# EAGLE schematic esp32_cam_rev_B (EAGLE 9.6.2)
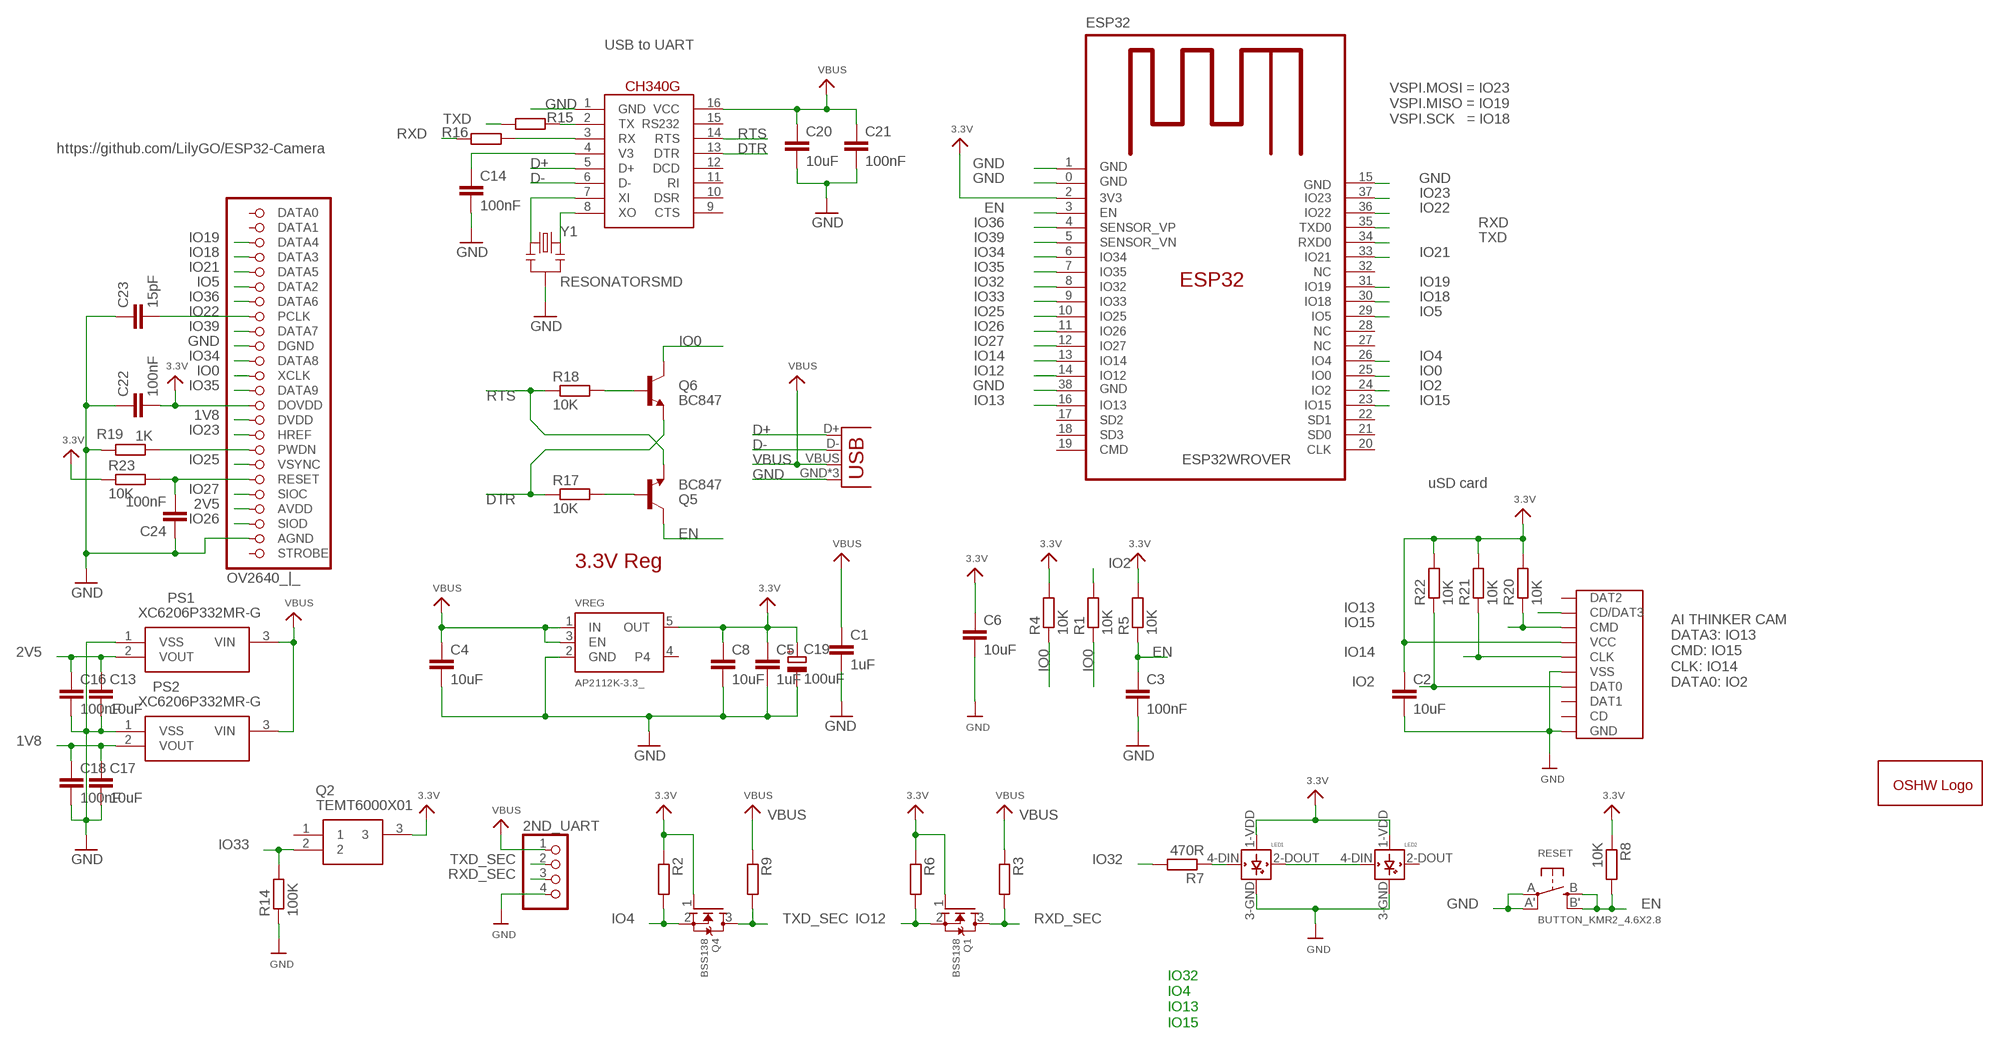
[diagram p0: schematic, sheet 1]

## Parts
2ND_UART  JST_PH4  [JSTPH4]
C1  1uF  C-EUC0805K  [C0805K]
C2  10uF  C-EUC0805  [C0805]
C3  100nF  C-EUC0805K  [C0805K]
C4  10uF  C-EUC0805  [C0805]
C5  1uF  C-EUC0805  [C0805]
C6  10uF  C-EUC0805K  [C0805K]
C8  10uF  C-EUC0805  [C0805]
C13  10uF  C-EUC0805  [C0805]
C14  100nF  C-EUC0805K  [C0805K]
C16  100nF  C-EUC0805  [C0805]
C17  10uF  C-EUC0805  [C0805]
C18  100nF  C-EUC0805  [C0805]
C19  100uF  CPOL-EUCT6032  [CT6032]
C20  10uF  C-EUC0805  [C0805]
C21  100nF  C-EUC0805  [C0805]
C22  100nF  C-EUC0805  [C0805]
C23  15pF  C-EUC0805  [C0805]
C24  100nF  C-EUC0805  [C0805]
CH340G  CH340G  [SO16]
ESP32  ESP32WROVER  [ESP32WROVER]
FPC_CONNECTOR  OV2640_|_  [5051102491]
GOLD_ORB_SM1  OSHWLOGO_  [OSHW_5MM_LOGO]
LED1  WS2812B  [WS2812B_5050]
LED2  WS2812B  [WS2812B_5050]
PS1  XC6206P332MR-G  [SOT95P280X130-3N]
PS2  XC6206P332MR-G  [SOT95P280X130-3N]
Q1  BSS138  MOSFET_N_  [SOT95P240X110-3]
Q2  TEMT6000X01  [TEMT6000X01]
Q4  BSS138  MOSFET_N_  [SOT95P240X110-3]
Q5  BC847  TRANSISTOR_NPNSOT23-3  [SOT23-3]
Q6  BC847  TRANSISTOR_NPNSOT23-3  [SOT23-3]
R1  10K  R-EU_R0805  [R0805]
R2  10K  R-EU_R0805  [R0805]
R3  10K  R-EU_R0805  [R0805]
R4  10K  R-EU_R0805  [R0805]
R5  10K  R-EU_R0805  [R0805]
R6  10K  R-EU_R0805  [R0805]
R7  470R  R-EU_R0805  [R0805]
R8  10K  R-EU_R0805  [R0805]
R9  10K  R-EU_R0805  [R0805]
R14  100K  R-EU_R0805  [R0805]
R15  470R  R-EU_R0805  [R0805]
R16  470R  R-EU_R0805  [R0805]
R17  10K  R-EU_R0805  [R0805]
R18  10K  R-EU_R0805  [R0805]
R19  1K  R-EU_R0805  [R0805]
R20  10K  R-EU_R0805  [R0805]
R21  10K  R-EU_R0805  [R0805]
R22  10K  R-EU_R0805  [R0805]
R23  10K  R-EU_R0805  [R0805]
RESET  BUTTON_KMR2_4.6X2.8  [BUTTON_KMR2_4.6X2.8]
SD_CARD  MICRO_SD_CARD_  [TFP09-2--12B]
USB  USB_MICRO_ATTEND_  [USB_MICRO]
VREG  AP2112K-3.3_  [SOT95P290X120-5]
Y1  RESONATORSMD  [RESONATOR-SMD]

## Nets
1V8: C17.1 C18.1 FPC_CONNECTOR.15(DVDD) PS2.2(VOUT)
2V5: C13.1 C16.1 FPC_CONNECTOR.21(AVDD) PS1.2(VOUT)
3.3V: C2.1 C5.1 C6.1 C8.1 C19.+ C22.2 ESP32.2(3V3) FPC_CONNECTOR.14(DOVDD) LED1.1-VDD(VDD) LED2.1-VDD(VDD) Q1.1(G) Q2.3 Q4.1(G) R2.1 R4.2 R5.2 R6.1 R8.1 R20.2 R21.2 R22.2 R23.1 SD_CARD.VCC VREG.5(OUT)
D+: CH340G.5(D+) USB.D+
D-: CH340G.6(D-) USB.D-
DTR: CH340G.13(DTR) Q6.2(E) R17.1
EN: C3.1 ESP32.3(EN) Q5.3(C) R5.1 R8.2 RESET.B'(S1) RESET.B(S)
GND: 2ND_UART.4 C1.2 C2.2 C3.2 C4.2 C5.2 C6.2 C8.2 C13.2 C14.2 C16.2 C17.2 C18.2 C19.- C20.2 C21.2 C22.1 C23.1 C24.1 CH340G.1(GND) ESP32.0(GND) ESP32.1(GND) ESP32.15(GND) ESP32.38(GND) FPC_CONNECTOR.10(DGND) FPC_CONNECTOR.23(AGND) LED1.3-GND(GND) LED2.3-GND(GND) PS1.1(VSS) PS2.1(VSS) R14.1 R19.2 RESET.A'(P1) RESET.A(P) SD_CARD.GND SD_CARD.GND@1(GND) SD_CARD.GND@2(GND) SD_CARD.GND@3(VSS) SD_CARD.VSS(GND) USB.GND USB.GND@2(GND) USB.GND@3(GND) VREG.2(GND) Y1.2
IO0: ESP32.25(IO0) FPC_CONNECTOR.12(XCLK) Q6.3(C) R1.1 R4.1
IO2: ESP32.24(IO2) R1.2 R22.1 SD_CARD.DAT0
IO4: ESP32.26(IO4) Q4.2(S) R2.2
IO5: ESP32.29(IO5) FPC_CONNECTOR.6(DATA2)
IO12: ESP32.14(IO12) Q1.2(S) R6.2
IO13: ESP32.16(IO13) SD_CARD.CD/DAT3
IO14: ESP32.13(IO14) R21.1 SD_CARD.CLK
IO15: ESP32.23(IO15) R20.1 SD_CARD.CMD
IO18: ESP32.30(IO18) FPC_CONNECTOR.4(DATA3)
IO19: ESP32.31(IO19) FPC_CONNECTOR.3(DATA4)
IO21: ESP32.33(IO21) FPC_CONNECTOR.5(DATA5)
IO22: C23.2 ESP32.36(IO22) FPC_CONNECTOR.8(PCLK)
IO23: ESP32.37(IO23) FPC_CONNECTOR.16(HREF)
IO25: ESP32.10(IO25) FPC_CONNECTOR.18(VSYNC)
IO26: ESP32.11(IO26) FPC_CONNECTOR.22(SIOD)
IO27: ESP32.12(IO27) FPC_CONNECTOR.20(SIOC)
IO32: ESP32.8(IO32) R7.2
IO33: ESP32.9(IO33) Q2.2 R14.2
IO34: ESP32.6(IO34) FPC_CONNECTOR.11(DATA8)
IO35: ESP32.7(IO35) FPC_CONNECTOR.13(DATA9)
IO36: ESP32.4(SENSOR_VP) FPC_CONNECTOR.7(DATA6)
IO39: ESP32.5(SENSOR_VN) FPC_CONNECTOR.9(DATA7)
N$2: LED1.4-DIN(DIN) R7.1
N$3: LED1.2-DOUT(DOUT) LED2.4-DIN(DIN)
N$8: CH340G.8(XO) Y1.3
N$16: CH340G.7(XI) Y1.1
N$22: C14.1 CH340G.4(V3)
N$23: CH340G.2(TX) R15.1
N$24: CH340G.3(RX) R16.1
N$25: Q5.1(B) R17.2
N$26: Q6.1(B) R18.2
N$32: FPC_CONNECTOR.17(PWDN) R19.1
N$34: C24.2 FPC_CONNECTOR.19(RESET) R23.2
RTS: CH340G.14(RTS) Q5.2(E) R18.1
RXD: ESP32.35(TXD0) R16.2
RXD_SEC: 2ND_UART.3 Q1.3(D) R3.2
TXD: ESP32.34(RXD0) R15.2
TXD_SEC: 2ND_UART.2 Q4.3(D) R9.2
VBUS: 2ND_UART.1 C1.1 C4.1 C20.1 C21.1 CH340G.16(VCC) PS1.3(VIN) PS2.3(VIN) R3.1 R9.1 USB.VBUS VREG.1(IN) VREG.3(EN)
Unconnected: CH340G.9(CTS) CH340G.10(DSR) CH340G.11(RI) CH340G.12(DCD) CH340G.15(RS232) ESP32.17(SD2) ESP32.18(SD3) ESP32.19(CMD) ESP32.20(CLK) ESP32.21(SD0) ESP32.22(SD1) ESP32.27(NC) ESP32.28(NC) ESP32.32(NC) FPC_CONNECTOR.1(DATA0) FPC_CONNECTOR.2(DATA1) FPC_CONNECTOR.24(STROBE) LED2.2-DOUT(DOUT) Q2.1 SD_CARD.CD SD_CARD.DAT1 SD_CARD.DAT2 VREG.4

## Notes on the sheet
- USB to UART
- VSPI.MOSI = IO23
  VSPI.MISO = IO19
  VSPI.SCK   = IO18
- https://github.com/LilyGO/ESP32-Camera
- uSD card
- 3.3V Reg
- AI THINKER CAM 
  DATA3: IO13
  CMD: IO15
  CLK: IO14
  DATA0: IO2
- IO32
  IO4
  IO13
  IO15

## Library data of the parts
2ND_UART = dronecz:JST_PH4: JST 4-Pin Right-Angle Connector 4UConnector: 17312
C1-C6 C8 C13 C14 C16-C18 C20-C24 = rcl:C-EU: CAPACITOR, European symbol; SPICEPREFIX: C
C19 = rcl:CPOL-EU: POLARIZED CAPACITOR, European symbol; SPICEPREFIX: C
CH340G = dronecz:CH340G
ESP32 = dronecz:ESP32WROVER
FPC_CONNECTOR = dronecz:OV2640
GOLD_ORB_SM1 = oshw:OSHWLOGO: The OSHW logo for PCB layout
LED1 LED2 = dronecz:WS2812B
PS1 PS2 = SamacSys_Parts:XC6206P332MR-G: LDO Voltage Regulators Source: Datasheet <https://www.torexsemi.com/file/xc6206/XC6206.pdf>; DESCRIPTION: LDO Voltage Regulators; HEIGHT: 1.3mm; MANUFACTURER_NAME: Torex; MANUFACTURER_PART_NUMBER: XC6206P332MR-G; MOUSER_PART_NUMBER: 865-XC6206P332MR-G
Q1 Q4 = dronecz:MOSFET_N
Q2 = SamacSys_Parts:TEMT6000X01: Ambient Light Sensor 570nm SMD3 Vishay TEMT6000X01 +/-60 Visible Light Phototransistor, Surface Mount 3-Pin 1206 package Source: Datasheet <https://componentsearchengine.com/Datasheets/1/TEMT6000X01.pdf>; DESCRIPTION: Ambient Light Sensor 570nm SMD3 Vishay TEMT6000X01 +/-60 Visible Light Phototransistor, Surface Mount 3-Pin 1206 package; HEIGHT: mm; MANUFACTURER_NAME: Vishay; MANUFACTURER_PART_NUMBER: TEMT6000X01; MOUSER_PART_NUMBER: 78-TEMT6000
Q5 Q6 = SparkFun:TRANSISTOR_NPN: Transistor NPN BJT configuration in SOT23 package. MMBT2222 is the common NPN we use. Double check BCE configuration again layout.
R1-R9 R14-R23 = rcl:R-EU_: RESISTOR, European symbol; SPICEPREFIX: R
RESET = dronecz:BUTTON_KMR2_4.6X2.8: SMT Tact Switches 6x6mm - Digikey: P12940SCT-ND KMR2 (4.6x2.8mm) - Digikey: 401-1426-1-ND EVQ-PQHB55 - Light Touch, 160GF (4.5x4.5mm) - Digikey: P8090SCT-ND Farnell (KMR221NG) - 2845727
SD_CARD = dronecz:MICRO_SD_CARD
USB = dronecz:USB_MICRO_ATTEND: https://www.tme.eu/cz/Document/1cbb1fe1d020818ecbe0fffe16726397/207A-BBA0-R.pdf
VREG = dronecz:AP2112K-3.3
Y1 = SparkFun:RESONATOR: Resonator Small SMD resonator. This is the itty bitty 10/20MHz resonators with built in caps. CSTCE10M0G55 and CSTCE20M0V53. Footprint has been reviewed closely but hasn't been tested yet.